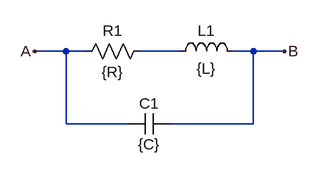
[diagram p0: schematic resistor-non-ideal.asc]
resistor-non-ideal.asc, the LTspice schematic file:
Version 4
SHEET 1 880 680
WIRE -64 -16 -112 -16
WIRE -32 -16 -64 -16
WIRE 112 -16 48 -16
WIRE 224 -16 192 -16
WIRE 272 -16 224 -16
WIRE -64 96 -64 -16
WIRE 32 96 -64 96
WIRE 224 96 224 -16
WIRE 224 96 96 96
FLAG -112 -16 A
FLAG 272 -16 B
SYMBOL res -48 0 R270
WINDOW 0 32 56 VTop 2
WINDOW 3 0 56 VBottom 2
SYMATTR InstName R1
SYMATTR Value {R}
SYMBOL ind 96 0 R270
WINDOW 0 32 56 VTop 2
WINDOW 3 5 56 VBottom 2
SYMATTR InstName L1
SYMATTR Value {L}
SYMBOL cap 32 112 R270
WINDOW 0 32 32 VTop 2
WINDOW 3 0 32 VBottom 2
SYMATTR InstName C1
SYMATTR Value {C}

The netlist it stands for:
* resistor-non-ideal.asc
R1 A N001 {R}
L1 N001 B {L}
C1 A B {C}
.backanno
.end